# EAGLE design FEU_Last (EAGLE 6.1)
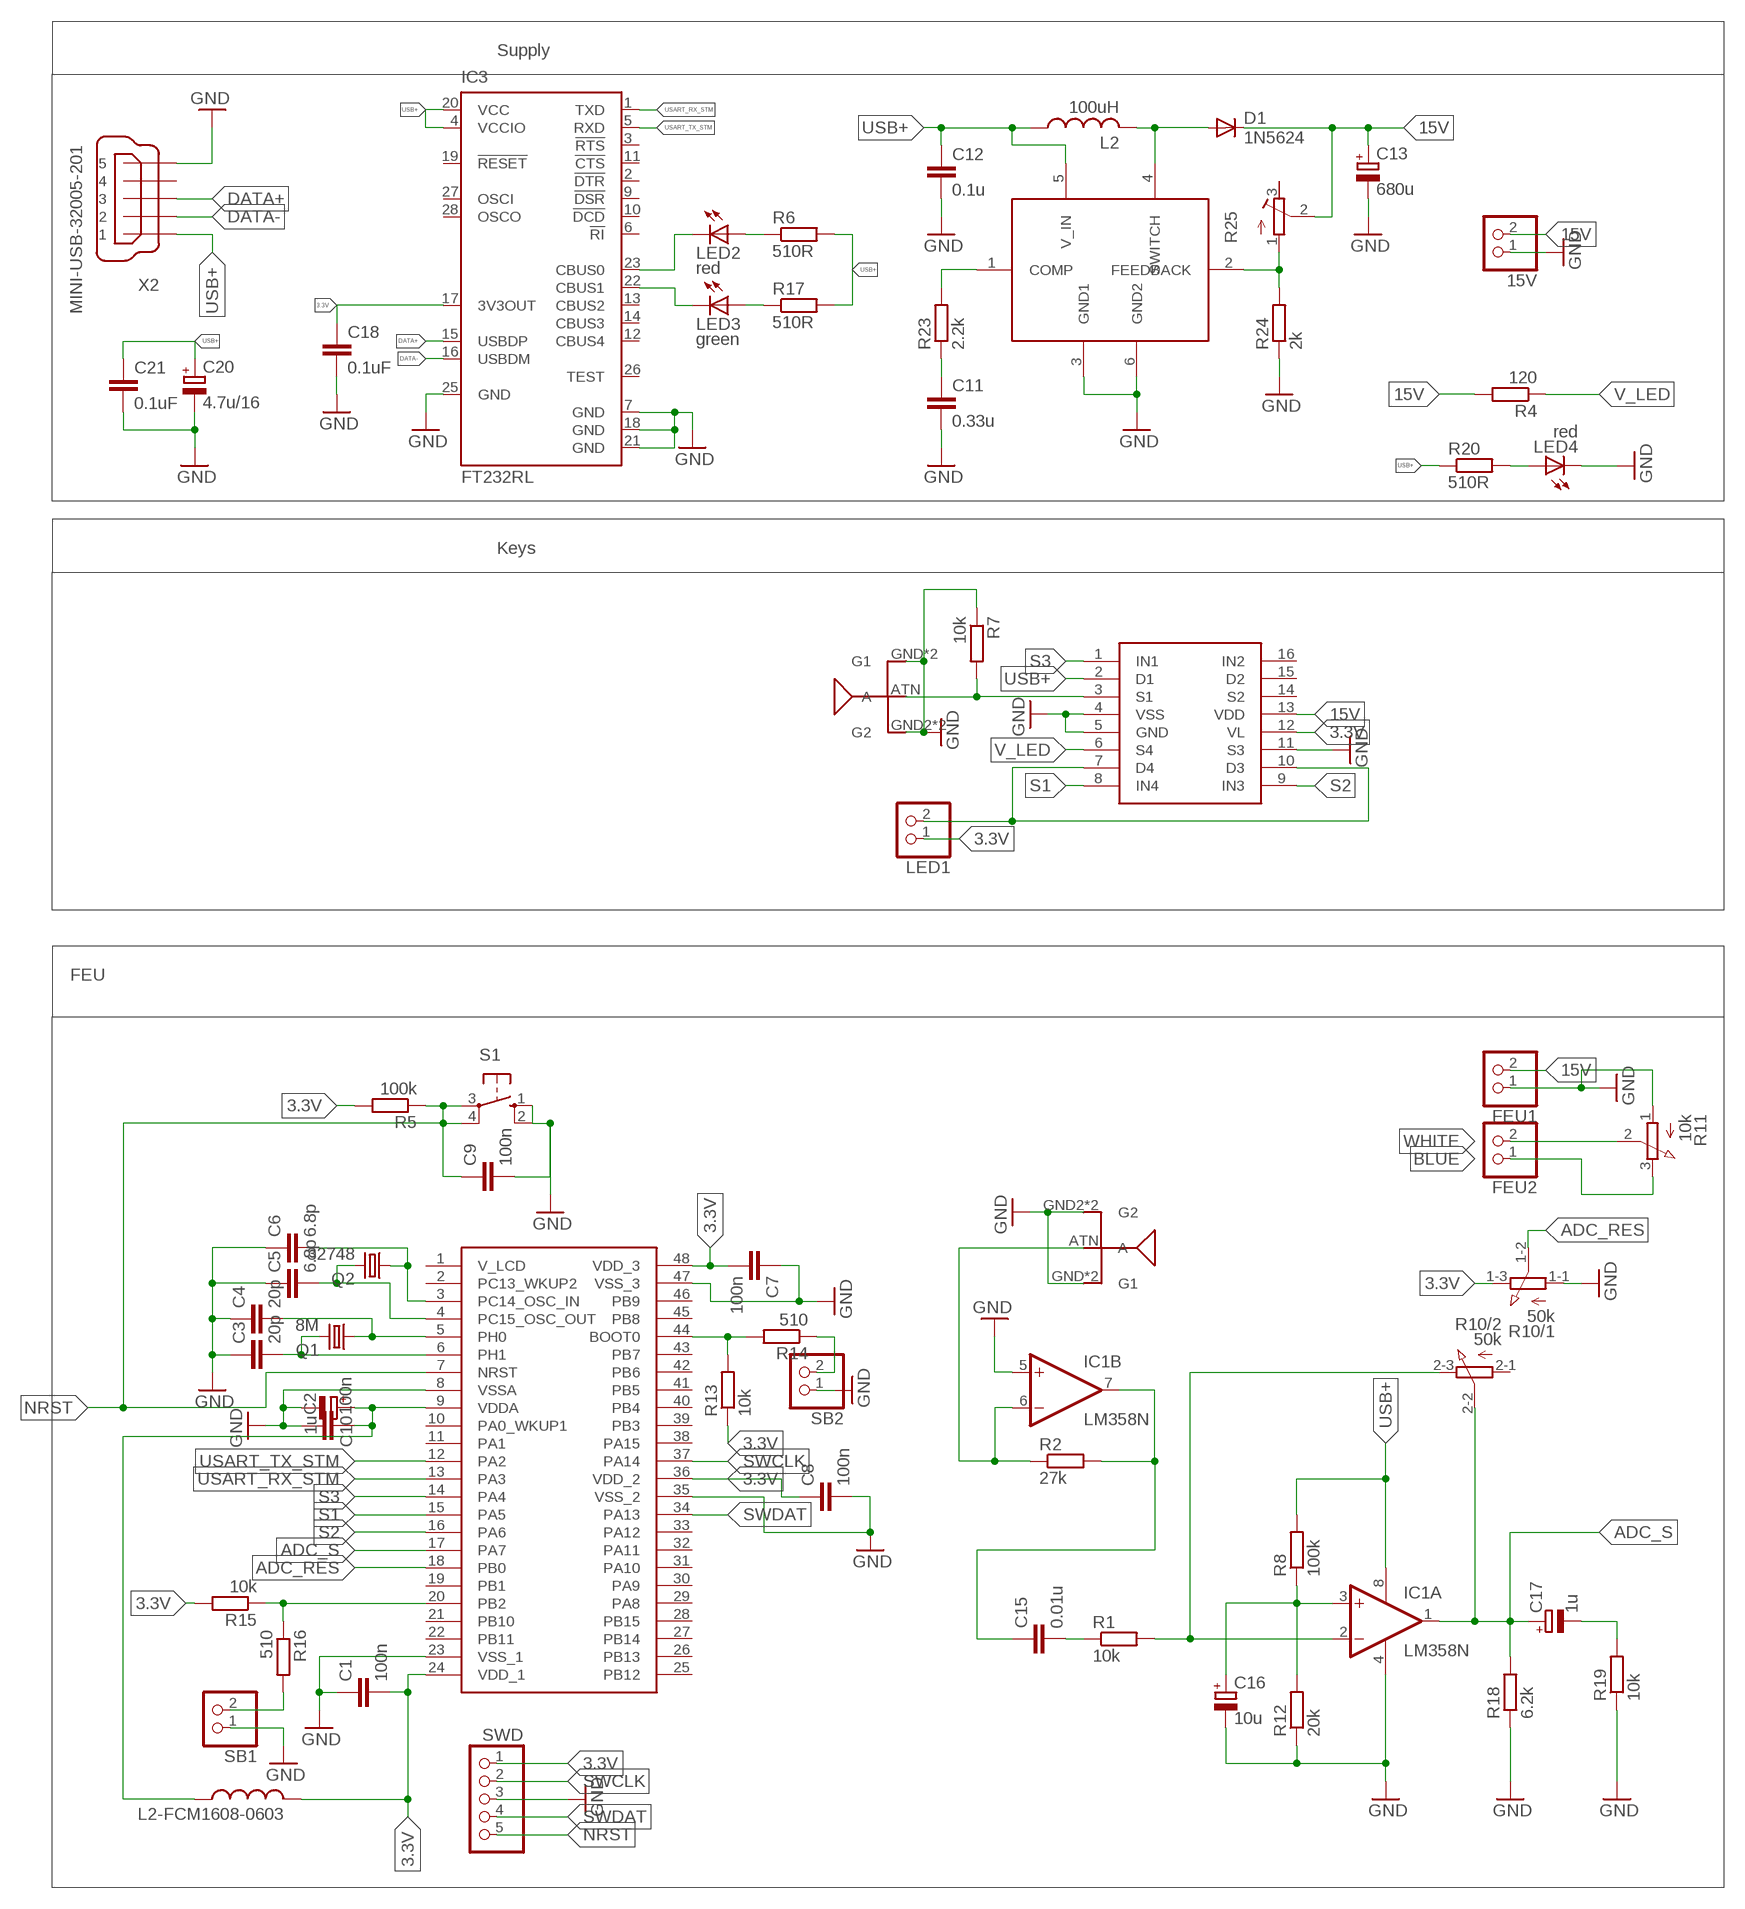
[diagram p0: schematic, sheet 1]

## Parts
15V  PINHD-1X2  [1X02]
C1  100n  C-EUC0805  [C0805]
C2  100n  C-EUC0805  [C0805]
C3  20p  C-EUC0805  [C0805]
C4  20p  C-EUC0805  [C0805]
C5  6.8p  C-EUC0805  [C0805]
C6  6.8p  C-EUC0805  [C0805]
C7  100n  C-EUC0805  [C0805]
C8  100n  C-EUC0805  [C0805]
C9  100n  C-EUC0805  [C0805]
C10  1u  CPOL-EUA/3216-18W  [A/3216-18W]
C11  0.33u  C-EUC0805  [C0805]
C12  0.1u  C-EUC0805  [C0805]
C13  680u  CPOL-EUE5-5  [E5-5]
C15  0.01u  C-EUC0805  [C0805]
C16  10u  CPOL-EUE3.5-8  [E3,5-8]
C17  1u  CPOL-EUE3.5-8  [E3,5-8]
C18  0.1uF  C-EUC0805  [C0805]
C20  4.7u/16  CPOL-EUE2-5  [E2-5]
C21  0.1uF  C-EUC0805  [C0805]
D1  1N5624  [DO201-15]
FEU1  PINHD-1X2  [1X02]
FEU2  PINHD-1X2  [1X02]
IC1  LM358N  [DIL08]
IC3  FT232RL  [SSOP28]
L2  100uH  L-US0207/5V  [0207/5V]
L2-FCM1608-0603  L-USL3216C  [L3216C]
LED1  PINHD-1X2  [1X02]
LED2  red  LEDCHIPLED_1206  [CHIPLED_1206]
LED3  green  LEDCHIPLED_1206  [CHIPLED_1206]
LED4  red  LEDCHIPLED_1206  [CHIPLED_1206]
Q1  8M  CRYSTALHC49S  [HC49/S]
Q2  32748  CRYSTALTC26H  [TC26H]
R1  10k  R-EU_R0805  [R0805]
R2  27k  R-EU_R0805  [R0805]
R4  120  R-EU_R0805  [R0805]
R5  100k  R-EU_R0805  [R0805]
R6  510R  R-EU_R0805W  [R0805W]
R7  10k  R-EU_R0805  [R0805]
R8  100k  R-EU_R0805  [R0805]
R10  50k  3RP/1610G  [3RP/1610G]
R11  10k  3RP/1610N  [3RP/1610N]
R12  20k  R-EU_R0805  [R0805]
R13  10k  R-EU_R0805  [R0805]
R14  510  R-EU_R0805  [R0805]
R15  10k  R-EU_M0805  [M0805]
R16  510  R-EU_R0805  [R0805]
R17  510R  R-EU_R0805W  [R0805W]
R18  6.2k  R-EU_R0805  [R0805]
R19  10k  R-EU_R0805  [R0805]
R20  510R  R-EU_R0805W  [R0805W]
R23  2.2k  R-EU_R0805  [R0805]
R24  2k  R-EU_R0805  [R0805]
R25  R-TRIMM3339P  [RTRIM3339P]
S1  10-XX  [B3F-10XX]
SB1  PINHD-1X2  [1X02]
SB2  PINHD-1X2  [1X02]
SWD  PINHD-1X5  [1X05]
U$1  STM32L152C6  [LQFP48]
U$2  GSM_ANT  [GSM]
U$3  GSM_ANT  [GSM]
U$4  LM2577  [TO263-5]
U$5  ADG433BN  [DIL16]
X2  MINI-USB-32005-201  [32005-201]

## Nets
3.3V: C1.2 C7.2 C8.1 C18.1 IC3.17(3V3OUT) L2-FCM1608-0603.2 LED1.1 R5.2 R10.1-3(/1:E) R13.1 R15.2 SWD.1 U$1.24(VDD_1) U$1.36(VDD_2) U$1.48(VDD_3) U$5.12(VL)
15V: 15V.2 C13.+ D1.C FEU1.2 R4.2 R25.2(S) U$5.13(VDD)
ADC_RES: R10.1-2(/1:S) U$1.18(PB0)
ADC_S: C17.+ IC1.1(A:OUT) R10.2-2(/2:S) R18.2 U$1.17(PA7)
BLUE: FEU2.1 R11.3(E)
DATA+: IC3.15(USBDP) X2.3
DATA-: IC3.16(USBDM) X2.2
GND: 15V.1 C1.1 C2.1 C3.1 C4.1 C5.1 C6.1 C7.1 C8.2 C9.2 C10.- C11.2 C12.2 C13.- C16.- C18.2 C20.- C21.2 FEU1.1 IC1.4(P:V-) IC1.5(B:+IN) IC3.7(GND) IC3.18(GND) IC3.21(GND) IC3.25(GND) LED4.C R7.1 R10.1-1(/1:A) R11.1(A) R12.1 R18.1 R19.1 R24.1 S1.1(S) S1.2(S1) SB1.1 SB2.1 SWD.3 U$1.8(VSSA) U$1.23(VSS_1) U$1.35(VSS_2) U$1.47(VSS_3) U$2.GND1(G1) U$2.GND2(G2) U$2.GND3(G2) U$2.GND(G1) U$3.GND1(G1) U$3.GND2(G2) U$3.GND3(G2) U$3.GND(G1) U$4.3(GND1) U$4.6(GND2) U$5.4(VSS) U$5.5(GND) U$5.11(S3) X2.5
N$1: C4.2 Q1.1 U$1.5(PH0)
N$2: C3.2 Q1.2 U$1.6(PH1)
N$3: IC3.22(CBUS1) LED3.C
N$4: LED1.2 U$5.7(D4) U$5.10(D3)
N$5: IC3.23(CBUS0) LED2.C
N$6: IC1.6(B:-IN) R2.1 U$2.ATN(A)
N$7: C15.1 IC1.7(B:OUT) R2.2
N$9: C15.2 R1.1
N$10: C16.+ IC1.3(A:+IN) R8.1 R12.2
N$11: IC1.2(A:-IN) R1.2 R10.2-3(/2:E)
N$12: LED2.A R6.1
N$13: C5.2 Q2.2 U$1.4(PC15_OSC_OUT)
N$14: C6.2 Q2.1 U$1.3(PC14_OSC_IN)
N$15: C2.2 C10.+ L2-FCM1608-0603.1 U$1.9(VDDA)
N$16: R13.2 R14.2 U$1.44(BOOT0)
N$17: R16.2 SB1.2
N$18: R14.1 SB2.2
N$19: R15.1 R16.1 U$1.20(PB2)
N$20: C17.- R19.2
N$21: LED3.A R17.1
N$23: R7.2 U$3.ATN(A) U$5.3(S1)
N$24: LED4.A R20.2
N$26: R23.2 U$4.1(COMP)
N$27: C11.1 R23.1
N$28: R24.2 R25.1(E) U$4.2(FEEDBACK)
N$31: D1.A L2.2 U$4.4(SWITCH)
NRST: C9.1 R5.1 S1.3(P) S1.4(P1) SWD.5 U$1.7(NRST)
S1: U$1.15(PA5) U$5.8(IN4)
S2: U$1.16(PA6) U$5.9(IN3)
S3: U$1.14(PA4) U$5.1(IN1)
SWCLK: SWD.2 U$1.37(PA14)
SWDAT: SWD.4 U$1.34(PA13)
USART_RX_STM: IC3.1(TXD) U$1.13(PA3)
USART_TX_STM: IC3.5(RXD) U$1.12(PA2)
USB+: C12.1 C20.+ C21.1 IC1.8(P:V+) IC3.4(VCCIO) IC3.20(VCC) L2.1 R6.2 R8.2 R17.2 R20.1 U$4.5(V_IN) U$5.2(D1) X2.1
V_LED: R4.1 U$5.6(S4)
WHITE: FEU2.2 R11.2(S)
Unconnected: IC3.2(!DTR) IC3.3(!RTS) IC3.6(!RI) IC3.9(!DSR) IC3.10(!DCD) IC3.11(!CTS) IC3.12(CBUS4) IC3.13(CBUS2) IC3.14(CBUS3) IC3.19(!RESET) IC3.26(TEST) IC3.27(OSCI) IC3.28(OSCO) R10.2-1(/2:A) R25.3(A) U$1.1(V_LCD) U$1.2(PC13_WKUP2) U$1.10(PA0_WKUP1) U$1.11(PA1) U$1.19(PB1) U$1.21(PB10) U$1.22(PB11) U$1.25(PB12) U$1.26(PB13) U$1.27(PB14) U$1.28(PB15) U$1.29(PA8) U$1.30(PA9) U$1.31(PA10) U$1.32(PA11) U$1.33(PA12) U$1.38(PA15) U$1.39(PB3) U$1.40(PB4) U$1.41(PB5) U$1.42(PB6) U$1.43(PB7) U$1.45(PB8) U$1.46(PB9) U$5.14(S2) U$5.15(D2) U$5.16(IN2) X2.4

## Notes on the sheet
- Supply
- Keys
- FEU

## Library data of the parts
15V FEU1 FEU2 LED1 SB1 SB2 = pinhead:PINHD-1X2: PIN HEADER
C1-C9 C11 C12 C15 C18 C21 = resistor:C-EU: CAPACITOR, European symbol
C10 C13 C16 C17 C20 = resistor:CPOL-EU: POLARIZED CAPACITOR, European symbol
D1 = diode:1N5624: DIODE controlled avalanche rectifier
IC1 = linear:LM358: OP AMP also LM158; LM258; LM2904 Source: http://cache.national.com/ds/LM/LM158.pdf
IC3 = ftdichip:FT232R: Source: http://www.ftdichip.com/Documents/DataSheets/DS_FT232R_v104.pdf; MPN: FT232RL; OC_FARNELL: 1146032; OC_NEWARK: 91K9918
L2 L2-FCM1608-0603 = resistor:L-US: INDUCTOR, American symbol
LED2-LED4 = led:LED: LED OSRAM: - CHIPLED LG R971, LG N971, LY N971, LG Q971, LY Q971, LO R971, LY R971 LH N974, LH R974 LS Q976, LO Q976, LY Q976 LO Q996 - Hyper CHIPLED LW Q18S LB Q993, LB Q99A, LB R99A - SideLED LS A670, LO A670, LY A670, LG A670, LP A670 LB A673, LV A673, LT A673, LW A673 LH A674 LY A675 LS A676, LA A676, LO A676, LY A676, LW A676 LS A679, LY A679, LG A679 - Hyper Micro SIDELED® LS Y876, LA Y876, LO Y876, LY Y876 LT Y87S - SmartLED LW L88C, LW L88S LB L89C, LB L89S, LG L890 LS L89K, LO L89K, LY L89K LS L896, LA L896, LO L896, LY L896 - TOPLED LS T670, LO T670, LY T670, LG T670, LP T670 LSG T670, LSP T670, LSY T670, LOP T670, LYG T670 LG T671, LOG T671, LSG T671 LB T673, LV T673, LT T673, LW T673 LH T674 LS T676, LA T676, LO T676, LY T676, LB T676, LH T676, LSB T676, LW T676 LB T67C, LV T67C, LT T67C, LS T67K, LO T67K, LY T67K, LW E67C LS E67B, LA E67B, LO E67B, LY E67B, LB E67C, LV E67C, LT E67C LW T67C LS T679, LY T679, LG T679 LS T770, LO T770, LY T770, LG T770, LP T770 LB T773, LV T773, LT T773, LW T773 LH T774 LS E675, LA E675, LY E675, LS T675 LS T776, LA T776, LO T776, LY T776, LB T776 LHGB T686 LT T68C, LB T68C - Hyper Mini TOPLED® LB M676 - Mini TOPLED Santana® LG M470 LS M47K, LO M47K, LY M47K Source: http://www.osram.convergy.de LUXEON: - LUMILED® LXK2-PW12-R00, LXK2-PW12-S00, LXK2-PW14-U00, LXK2-PW14-V00 LXK2-PM12-R00, LXK2-PM12-S00, LXK2-PM14-U00 LXK2-PE12-Q00, LXK2-PE12-R00, LXK2-PE12-S00, LXK2-PE14-T00, LXK2-PE14-U00 LXK2-PB12-K00, LXK2-PB12-L00, LXK2-PB12-M00, LXK2-PB14-N00, LXK2-PB14-P00, LXK2-PB14-Q00 LXK2-PR12-L00, LXK2-PR12-M00, LXK2-PR14-Q00, LXK2-PR14-R00 LXK2-PD12-Q00, LXK2-PD12-R00, LXK2-PD12-S00 LXK2-PH12-R00, LXK2-PH12-S00 LXK2-PL12-P00, LXK2-PL12-Q00, LXK2-PL12-R00 Source: www.luxeon.com KINGBRIGHT: KA-3528ASYC Source: www.kingbright.com
Q1 = crystal:CRYSTAL: CRYSTAL; OC_FARNELL: 1667008; OC_NEWARK: unknown
Q2 = crystal:CRYSTAL: CRYSTAL; OC_FARNELL: unknown; OC_NEWARK: unknown
R1 R2 R4-R8 R12-R20 R23 R24 = resistor:R-EU_: RESISTOR, European symbol
R10 = pot:3RP/1610G: 16mm Potentiometer two level Source: http://www.alphapotentiometers.net/html/16mm_pot_2.html
R11 = pot:3RP/1610N: 16mm Potentiometer one level Source: http://www.alphapotentiometers.net/html/16mm_pot_2.html
R25 = resistor:R-TRIMM: Trimm resistor
S1 = switch-omron:10-XX: OMRON SWITCH; MPN: B3F-1000; OC_FARNELL: 176432; OC_NEWARK: 36M3542
SWD = pinhead:PINHD-1X5: PIN HEADER
U$1 = STM32L152:STM32L152C6
U$2 U$3 = discrete:GSM_ANT
U$4 = LM2577:LM2577
U$5 = ADG433:ADG433BN
X2 = con-cypressindustries:MINI-USB-: MINI USB-B Conector Source: www.cypressindustries.com; OC_FARNELL: unknown; OC_NEWARK: unknown

## Board
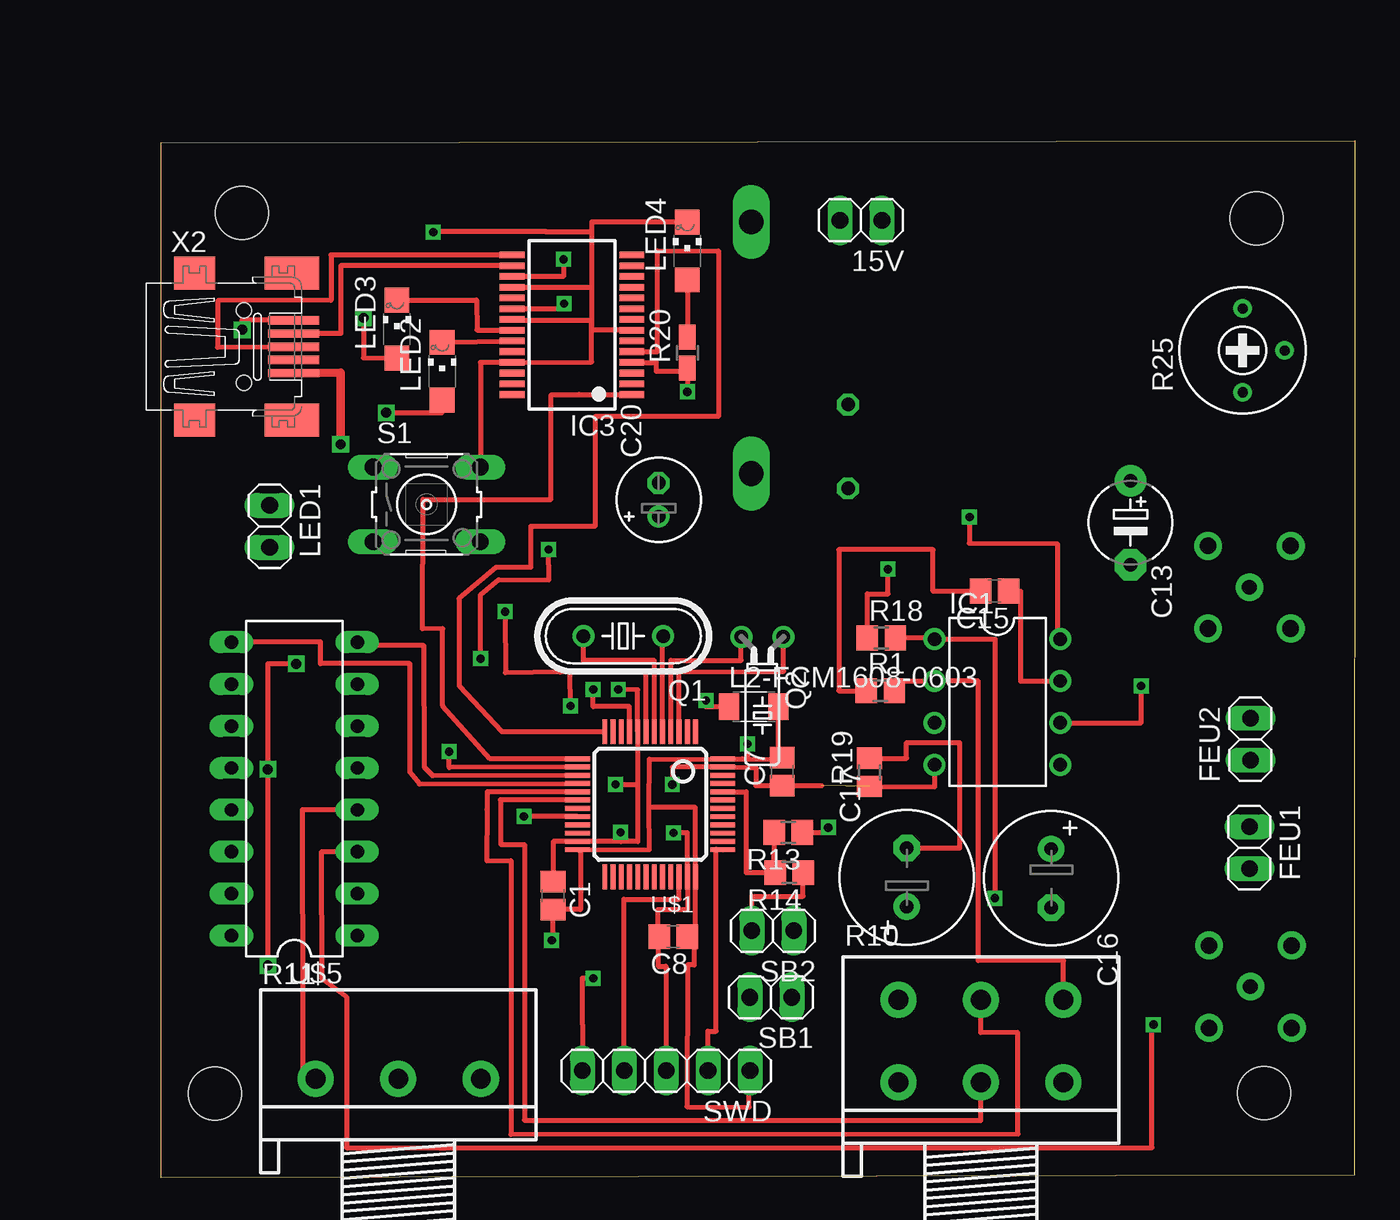
[diagram p1: board, top side]
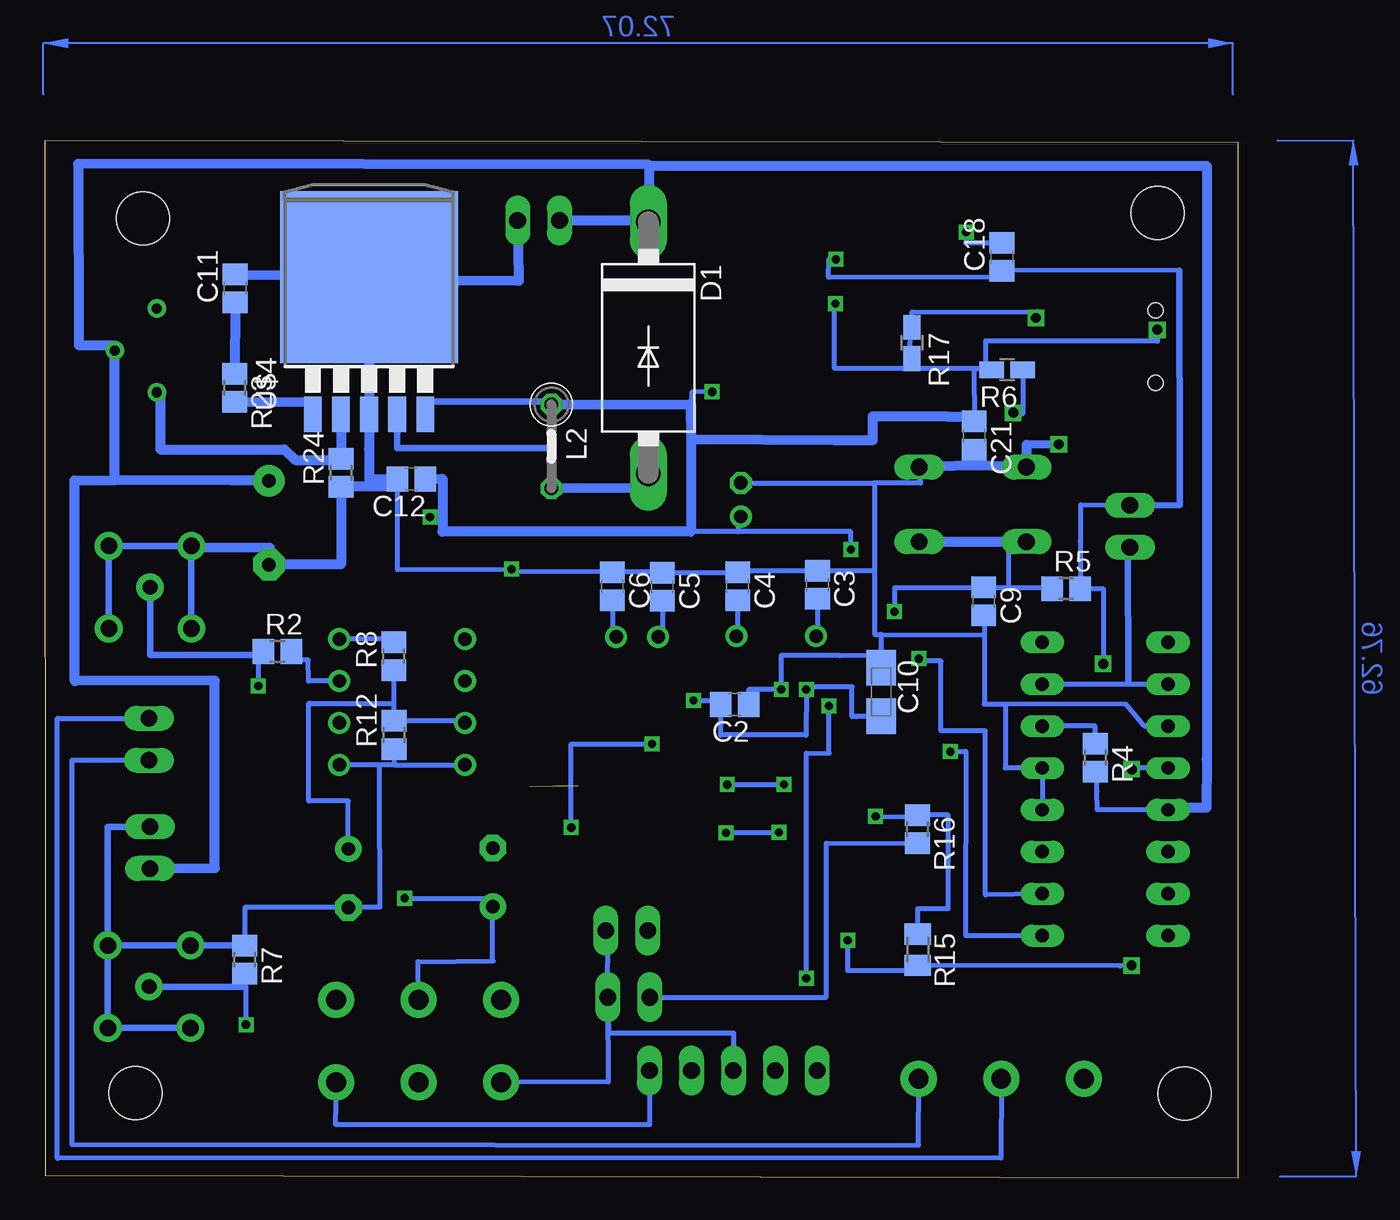
[diagram p2: board, bottom side, seen from below]

Size 72.31 x 62.84 mm. Coordinates in mm from the lower left corner, seen from the top.
Outline: 0.01,62.7 72.31,62.84 72.3,0.14 0,0 0.01,62.7
Copper layers (1*16): Top 0.035mm / dielectric 1.5mm / Bottom 0.035mm
Design rules: minimum track width 10mil, minimum drill 24mil, track to track 8mil, track to pad 8mil, pad to pad 8mil, via to via 8mil, smd to smd 8mil, copper to edge 40mil, drill to drill 8mil, minimum pad ring 10mil, minimum via ring 8mil, stop-mask expansion 4mil, vias tented up to drill 0mil, thermal gap 10mil
Holes 3.2 mm at 4.89,58.45 3.25,5.1 66.36,58.13 66.83,5.12

### Footprints (pad centres in the part's own frame; a part is rotated, then mirrored left to right if it is on the bottom)
1X02 = drill 1.016 long: 1 -1.27,0; 2 1.27,0
C0805 = smd 1.3 x 1.5: 1 -0.85,0; 2 0.85,0
A/3216-18W = smd 2.15 x 1.8: + 1.475,0; - -1.475,0
E5-5 = drill 0.813 pad 1.905: + -2.54,0 | drill 0.813 pad 1.905 octagon: - 2.54,0
E3,5-8 = drill 0.813 pad 1.6: + -1.778,0 | drill 0.813 pad 1.6 octagon: - 1.778,0
E2-5 = drill 0.813 pad 1.27: + -1.016,0 | drill 0.813 pad 1.27 octagon: - 1.016,0
DO201-15 = drill 1.499 long: A 7.62,0; C -7.62,0
DIL08 = drill 0.813 pad 1.27: 1 -3.81,-3.81; 2 -1.27,-3.81; 3 1.27,-3.81; 4 3.81,-3.81; 5 3.81,3.81; 6 1.27,3.81; 7 -1.27,3.81; 8 -3.81,3.81
SSOP28 = smd 0.4 x 1.5: 1 -4.225,-3.625; 2 -3.575,-3.625; 3 -2.925,-3.625; 4 -2.275,-3.625; 5 -1.625,-3.625; 6 -0.975,-3.625; 7 -0.325,-3.625; 8 0.325,-3.625; 9 0.975,-3.625; 10 1.625,-3.625; 11 2.275,-3.625; 12 2.925,-3.625; 13 3.575,-3.625; 14 4.225,-3.625; 15 4.225,3.625; 16 3.575,3.625; 17 2.925,3.625; 18 2.275,3.625; 19 1.625,3.625; 20 0.975,3.625; 21 0.325,3.625; 22 -0.325,3.625; 23 -0.975,3.625; 24 -1.625,3.625; 25 -2.275,3.625; 26 -2.925,3.625; 27 -3.575,3.625; 28 -4.225,3.625
0207/5V = drill 0.813 octagon: 1 -2.54,0; 2 2.54,0
L3216C = smd 1.2 x 1.6: 1 -1.5,0; 2 1.5,0
CHIPLED_1206 = smd 1.5 x 1.5: A 0,-1.75; C 0,1.75
HC49/S = drill 0.813: 1 -2.413,0; 2 2.413,0
TC26H = drill 0.813: 1 -1.27,0; 2 1.27,0
R0805 = smd 1.3 x 1.5: 1 -0.85,0; 2 0.85,0
R0805W = smd 1.5 x 1: 1 -0.94,0; 2 0.94,0
3RP/1610G = drill 1.2 pad 2.184: 1-1 -5,0; 1-2 0,0; 1-3 5,0; 2-1 -5,5; 2-2 0,5; 2-3 5,5
3RP/1610N = drill 1.2 pad 2.184: 1 -5,0; 2 0,0; 3 5,0
M0805 = smd 1.3 x 1.6: 1 -0.95,0; 2 0.95,0
RTRIM3339P = drill 0.61: 1 -2.54,0; 2 0,-2.54; 3 2.54,0
B3F-10XX = drill 1.016 long: 1 -3.251,2.261; 2 3.251,2.261; 3 -3.251,-2.261; 4 3.251,-2.261
1X05 = drill 1.016 long: 1 -5.08,0; 2 -2.54,0; 3 0,0; 4 2.54,0; 5 5.08,0
LQFP48 = smd 0.3 x 1.5: 1 -2.75,-4.4; 2 -2.25,-4.4; 3 -1.75,-4.4; 4 -1.25,-4.4; 5 -0.75,-4.4; 6 -0.25,-4.4; 7 0.25,-4.4; 8 0.75,-4.4; 9 1.25,-4.4; 10 1.75,-4.4; 11 2.25,-4.4; 12 2.75,-4.4; 25 2.75,4.4; 26 2.25,4.4; 27 1.75,4.4; 28 1.25,4.4; 29 0.75,4.4; 30 0.25,4.4; 31 -0.25,4.4; 32 -0.75,4.4; 33 -1.25,4.4; 34 -1.75,4.4; 35 -2.25,4.4; 36 -2.75,4.4 | smd 1.5 x 0.3: 13 4.4,-2.75; 14 4.4,-2.25; 15 4.4,-1.75; 16 4.4,-1.25; 17 4.4,-0.75; 18 4.4,-0.25; 19 4.4,0.25; 20 4.4,0.75; 21 4.4,1.25; 22 4.4,1.75; 23 4.4,2.25; 24 4.4,2.75; 37 -4.4,2.75; 38 -4.4,2.25; 39 -4.4,1.75; 40 -4.4,1.25; 41 -4.4,0.75; 42 -4.4,0.25; 43 -4.4,-0.25; 44 -4.4,-0.75; 45 -4.4,-1.25; 46 -4.4,-1.75; 47 -4.4,-2.25; 48 -4.4,-2.75
GSM = drill 0.9 pad 1.676: ATN 0,0 | drill 1 pad 1.676: GND -2.5,2.5; GND1 -2.5,-2.5; GND2 2.5,-2.5; GND3 2.5,2.5
TO263-5 = smd 1.067 x 2.159: 1 -3.404,-7.061; 2 -1.702,-7.061; 3 0,-7.061; 4 1.702,-7.061; 5 3.404,-7.061 | smd 10.8 x 10.41: 6 0,1.27
DIL16 = drill 0.813 long: 1 -7.62,-3.81; 2 -5.08,-3.81; 3 -2.54,-3.81; 4 0,-3.81; 5 2.54,-3.81; 6 5.08,-3.81; 7 7.62,-3.81; 8 10.16,-3.81; 9 10.16,3.81; 10 7.62,3.81; 11 5.08,3.81; 12 2.54,3.81; 13 0,3.81; 14 -2.54,3.81; 15 -5.08,3.81; 16 -7.62,3.81
32005-201 = smd 3.1 x 0.5: 1 3,1.6; 2 3,0.8; 3 3,0; 4 3,-0.8; 5 3,-1.6 | smd 2.5 x 2: M1 -3,-4.45; M2 -3,4.45 | smd 3.3 x 2: M3 2.9,4.45; M4 2.9,-4.45 | hole 0.9: 0,2.2; 0,-2.2

### Placement (x,y rotation side)
15V  42.4,58.01 180 top
C1  23.74,17.1 270 top
C2  30.52,28.68 180 bottom
C3  25.51,35.93 270 bottom
C4  30.34,35.84 270 bottom
C5  34.9,35.8 270 bottom
C6  37.93,35.84 270 bottom
C7  37.63,24.61 90 top
C8  31.03,14.61 180 top
C9  15.43,34.92 270 bottom
C10  21.64,29.43 270 bottom
C11  60.79,53.88 90 bottom
C12  50.11,42.34 180 bottom
C13  58.73,39.69 270 top
C15  50.51,35.55 180 top
C16  53.93,18.15 270 top
C17  45.18,18.2 90 top
C18  14.33,55.8 90 bottom
C20  30.14,41.08 90 top
C21  16.01,44.97 270 bottom
D1  35.75,50.29 270 bottom
FEU1  65.94,20 270 top
FEU2  66,26.57 90 top
IC1  50.67,28.83 270 top
IC3  24.89,51.68 90 top
L2  41.62,44.31 270 bottom
L2-FCM1608-0603  35.91,28.54 0 top
LED1  6.57,39.47 270 top
LED2  17.03,48.87 0 top
LED3  14.29,51.42 0 top
LED4  31.88,56.15 0 top
Q1  28,32.82 180 top
Q2  36.43,32.77 180 top
R1  43.58,29.51 0 top
R2  58.23,31.88 0 bottom
R4  8.67,25.46 270 bottom
R5  10.44,35.69 0 bottom
R6  14.01,48.96 180 bottom
R7  60.2,13.23 270 bottom
R8  51.17,31.61 90 bottom
R10  49.67,5.78 0 top
R11  14.37,5.99 0 top
R12  51.16,26.83 90 bottom
R13  38,20.93 180 top
R14  38.05,18.49 180 top
R15  19.43,13.82 270 bottom
R16  19.45,21.12 270 bottom
R17  19.78,50.58 270 bottom
R18  43.64,32.7 0 top
R19  42.92,24.56 90 top
R20  31.88,49.99 90 top
R23  60.82,47.87 270 bottom
R24  54.37,42.72 90 bottom
R25  65.53,50.13 90 top
S1  16.09,40.8 0 top
SB1  36.94,10.94 180 top
SB2  37.06,14.97 180 top
SWD  30.6,6.49 180 top
U$1  29.63,22.63 180 top
U$2  65.94,35.78 0 top
U$3  66,11.58 270 top
U$4  52.67,53.31 0 bottom
U$5  8.07,22.29 90 top
X2  5.03,50.35 0 top

### Tracks (layer width: path | path; a pad name or v marks a point on that pad's centre or on a via)
3.3V  (via drill 0.5, 0.6)
  Top 0.305: 35.35,25.38 35.21,25.38 U$1.48 29.58,25.36 29.57,22.43 | 35.35,25.38 37.33,25.36 | 37.33,25.36 C7.2 | 29.57,22.43 32.37,22.43 U$1.36 32.38,13.95 C8.1 32.11,14.06 32.3,14.09 32.3,12.89 31.88,12.89 31.86,4.31 35.63,4.28 35.63,6.35 SWD.1 | 29.57,22.43 29.58,19.89 U$1.24 25.4,19.88 25.4,16.25 C1.2 23.74,14.39 v23.67,14.39 | 37.33,25.36 37.41,25.36 L2-FCM1608-0603.2 | R13.1 40.42,20.93 v40.42,21.22 | v35.52,26.28 35.52,25.38 35.35,25.38 | v24.38,55.65 24.38,54.61 IC3.17 | v6.47,12.86 v6.46,24.75 6.47,31.14 v8.19,31.14
  Bottom 0.305: v40.42,21.22 40.42,26.28 v35.52,26.28 | SWD.1 35.67,3.22 54.69,3.22 54.65,5.95 R10.1-3 | v23.67,14.39 23.67,12.54 19.47,12.55 19.38,12.65 19.65,12.59 R15.2 7.17,12.83 v6.47,12.86 | LED1.1 9.57,40.77 9.57,39.8 9.58,38.57 R5.2 8.19,35.69 v8.19,31.14 | 3.59,54.97 3.58,54.98 C18.1 14.33,54.54 24.83,54.56 24.81,55.65 v24.38,55.65 | U$5.12 6.47,24.83 v6.46,24.75
  Bottom 0.406: LED1.1 3.55,40.76 3.55,42.02 3.59,54.97
15V
  Bottom 0.305: U$5.13 8.56,22.29 8.57,23.4 8.57,24.12 R4.2
  Bottom 0.406: D1.C 35.75,61.33 | 4.14,22.41 U$5.13
  Bottom 0.61: C13.+ 61.03,42.25 68.09,42.26 | 68.09,42.26 R25.2 68.07,50.44 70.26,50.44 70.3,61.44 35.72,61.38 D1.C 36.56,58.03 15V.2 | FEU1.2 62.01,18.77 62.01,30.13 70.5,30.09 70.51,42.25 68.09,42.26 | 35.75,61.33 1.92,61.31 1.92,25.37 1.93,22.41 4.14,22.41
ADC_RES
  Top 0.305: U$1.18 20.56,22.9 20.58,20.2 22.02,20.19 22.01,3.49 49.66,3.48 R10.1-2
ADC_S  (via drill 0.5)
  Top 0.305: R18.2 46.85,32.7 IC1.1 50.52,32.64 v50.52,16.94 | U$1.17 19.75,23.38 19.74,22.29 19.72,19.21 21.19,19.22 21.19,2.63 | 21.19,2.63 21.27,2.65 | 21.19,2.63 51.92,2.65 51.9,8.8 49.66,8.79 R10.2-2
  Bottom 0.305: R10.2-2 49.71,13.09 45.14,13.13 45.18,13.13 C17.+ 45.18,16.94 v50.52,16.94
BLUE
  Bottom 0.305: FEU2.1 70.68,25.3 70.68,2.02 19.38,1.98 R11.3
DATA+
  Top 0.305: IC3.15 10.29,55.91 10.29,53.17 3.43,53.14 3.42,50.32 7.94,50.35 X2.3
DATA-
  Top 0.305: IC3.16 10.88,55.25 10.88,51.15 8.19,51.15 | 7.99,51.15 8.19,51.15 | 8.19,51.15 6.81,51.2 X2.2
GND  (via drill 0.5, 0.6)  (1 unrouted)
  Top 0.305: C1.1 23.75,20.38 U$1.23 27.84,20.38 | 28.88,23.83 U$1.8 28.88,29.57 v27.7,29.58 | 28.88,23.83 28.88,20.38 27.84,20.38 | v30.97,23.82 30.97,24.89 U$1.47 35.66,24.87 36.04,24.86 36.04,23.76 C7.1 40.02,23.76 | v27.53,23.83 28.88,23.83 | v31.04,20.89 31.88,20.9 U$1.35 31.88,16.24 30.08,16.24 30.08,14.48 30.12,13.66 | v27.84,20.92 27.84,20.38 | 42.92,23.75 R19.1 46.87,23.69 IC1.4 | C8.2 30.12,13.66 | 30.12,13.66 30.12,12.81 30.59,12.81 SWD.3 | R18.1 42.79,35.37 44.04,35.37 v44.04,36.87 | U$5.4 8.55,22.29 8.59,9.65 8.59,5.99 R11.1 | IC3.21 21.27,51.97 26.08,51.97 | IC3.7 26.08,51.36 26.08,51.72 | LED4.C 26.08,57.9 26.08,57.33 | 26.08,57.33 26.09,53.96 | 26.09,53.96 26.08,51.72 | 23.31,53.95 IC3.18 23.34,53.95 23.35,53.96 26.09,53.96 | v16.49,57.3 16.49,57.32 23.31,57.32 23.31,57.33 26.08,57.33 | 26.08,51.97 26.09,51.97 26.09,49.42 IC3.25 19.34,49.41 S1.2 | 26.08,51.97 26.08,51.72
  Top 0.5: X2.5 10.87,48.78 v10.88,44.44
  Bottom 0.305: v30.97,23.82 v27.53,23.83 | v31.04,20.89 30.81,20.92 v27.84,20.92 | C2.1 29.67,29.58 v27.7,29.58 27.7,31.63 24.16,31.63 21.69,31.62 C10.- 21.63,32.93 | 22.06,36.78 C3.1 30.34,36.78 C4.1 30.34,36.65 C5.1 34.9,36.69 C6.1 44.04,36.72 v44.04,36.87 50.96,36.85 50.96,41.87 | 22.06,36.78 22.05,32.93 21.63,32.93 | SB1.1 38.19,15.01 SB2.1 | SB1.1 38.18,5.8 R10.1-1 | SB1.1 38.16,8.77 30.59,8.78 30.59,7.4 SWD.3 | R12.1 51.16,25.02 | 51.16,25.02 IC1.4 | U$5.4 U$5.5 14.12,24.83 14.12,28.7 15.4,28.7 | S1.2 19.26,42.09 22.06,42.1 | 22.06,42.1 22.06,36.78 | R7.1 60.2,16.37 C16.- 52.02,16.39 52.06,23.5 52.06,25.02 | 51.16,25.02 52.06,25.02 | C9.2 14.97,33.93 15.4,33.94 15.4,32.9 | 15.4,32.9 15.4,28.7 | C20.- 22.06,42.1 | v16.49,57.3 16.52,56.65 C18.2 | C21.2 16.02,43.14 16.1,43.16 | U$5.11 5.69,27.37 6.8,28.68 15.4,28.7 | 21.63,32.93 15.4,32.9 | 52.06,25.02 IC1.5
  Bottom 0.406: U$3.GND U$3.GND3 U$3.GND2 | U$2.GND2 U$2.GND3 U$2.GND U$2.GND1 | U$3.GND U$3.GND1 R7.1 | FEU1.1 68.5,21.27 U$3.GND
  Bottom 0.5: v10.88,44.44 12.83,44.42
  Bottom 0.61: C11.2 52.67,54.66 U$4.6 | U$4.6 U$4.3 52.67,44.16 52.66,42.32 C12.2 50.96,41.87 R24.1 54.37,37.16 C13.- 58.67,38.18 63.45,38.17 U$2.GND | S1.2 16.1,43.16 S1.1 12.83,44.42 | 51.66,55.59 52.15,55.1 | 52.15,55.1 U$4.6 | 15V.1 43.61,54.35 51.33,54.32 51.33,55.1 52.15,55.1
N$1
  Top 0.305: U$1.5 30.38,32.82 Q1.1
  Bottom 0.305: C4.2 30.34,32.82 Q1.1
N$2
  Top 0.305: U$1.6 29.88,31.33 25.59,31.33 Q1.2
  Bottom 0.305: C3.2 25.51,32.82 Q1.2
N$3
  Top 0.305: LED3.C 19.11,53.18 19.13,51.36 IC3.22
N$4
  Bottom 0.305: U$5.7 6.68,29.91 6.68,29.98 6.61,29.91 U$5.10
  Bottom 0.406: 6.67,38.07 LED1.2 6.7,38.04 6.68,29.98
N$5
  Top 0.305: LED2.C 21.27,50.68 IC3.23
N$6  (via drill 0.5)
  Top 0.305: IC1.6 59.38,27.56 v59.38,29.8
  Bottom 0.305: R2.1 59.37,31.88 | v59.38,29.8 v59.37,29.8 59.37,31.69
  Bottom 0.406: U$2.ATN 65.94,31.69 59.37,31.69 59.37,31.88
N$7
  Top 0.305: C15.1 52.07,35.55 52.07,30.1 IC1.7
  Bottom 0.305: IC1.7 56.34,30.1 56.35,31.37 57.37,31.38 R2.2
N$9
  Top 0.305: C15.2 46.77,35.55 46.77,38.05 41.06,38.05 41.06,29.51 R1.1
N$10
  Bottom 0.305: IC1.3 46.86,27.68 R12.2 51.17,28.74 | R8.1 51.17,28.74 | C16.+ 53.93,22.83 56.33,22.83 56.33,28.74 51.17,28.74
N$11
  Top 0.305: R1.2 44.64,29.91 44.73,30.1 IC1.2 49.51,30.1 49.51,13.16 54.67,13.15 R10.2-3
N$12  (via drill 0.6)
  Top 0.305: v13.64,46.35 17.02,46.35 LED2.A
  Bottom 0.305: R6.1 13.06,49.02 13.06,46.3 v13.64,46.35
N$13
  Top 0.305: U$1.4 30.88,31.35 35.14,31.35 35.14,32.77 Q2.2
  Bottom 0.305: C5.2 34.9,32.77 Q2.2
N$14
  Top 0.305: U$1.3 31.38,30.66 37.72,30.68 37.72,32.79 Q2.1
  Bottom 0.305: C6.2 37.93,32.77 Q2.1
N$15  (via drill 0.5)
  Top 0.305: U$1.9 28.38,28.51 28.37,28.55 26.18,28.55 v26.18,29.58 | L2-FCM1608-0603.1 33.01,28.54 v33.01,28.92
  Bottom 0.305: 31.37,28.91 31.36,26.83 26.19,26.82 v26.18,29.58 26.17,29.75 25.91,29.74 23.4,29.74 23.4,27.95 23.16,27.95 C10.+ | v33.01,28.92 31.37,28.91 | 31.37,28.91 C2.2
N$16
  Top 0.305: U$1.44 35.45,23.38 35.45,18.49 R14.2 37.14,18.53 R13.2
N$17
  Bottom 0.305: SB1.2 24.97,10.94 24.96,20.28 R16.2
N$18
  Top 0.305: SB2.2 35.79,17.06 38.89,17.06 R14.1
N$19  (via drill 0.5)
  Top 0.305: U$1.20 21.98,21.88 v21.98,21.9
  Bottom 0.305: v21.98,21.9 19.46,21.87 R16.1 17.57,21.97 17.57,16.31 19.43,16.31 R15.1
N$20
  Top 0.305: R19.2 45.16,25.41 45.16,26.37 48.38,26.37 48.38,19.96 45.18,19.96 C17.-
N$21  (via drill 0.6)
  Top 0.305: v12.26,52.1 12.26,49.69 LED3.A
  Bottom 0.305: R17.1 19.78,52.46 12.18,52.48 v12.26,52.1
N$23  (via drill 0.5)
  Top 0.305: U$5.3 9.71,19.74 9.73,12.07 11.24,10.96 11.24,1.82 60.04,1.82 60.04,9.28 v60.13,9.28
  Bottom 0.305: v60.13,9.28 60.13,11.58 60.41,11.58
  Bottom 0.406: U$3.ATN 60.41,11.58 60.2,11.58 R7.2
N$24
  Top 0.305: LED4.A R20.2
N$26
  Bottom 0.61: R23.2 56.07,47 U$4.1
N$27
  Bottom 0.61: C11.1 R23.1
N$28
  Bottom 0.61: U$4.2 R24.2 54.45,43.49 57.16,43.49 57.8,44.13 65.31,44.13 65.31,47.52 R25.1
N$31
  Bottom 0.406: L2.2 41.62,44.19 41.71,44.2 50.97,44.21 U$4.4
  Bottom 0.61: D1.A 35.73,41.8 L2.2
NRST  (via drill 0.5)
  Top 0.305: U$1.7 29.38,30.61 25.19,30.64 24.2,30.64 | 24.2,30.64 20.86,30.6 20.85,34.21 v20.84,34.3 | v26.18,12.09 25.51,12.09 SWD.5 | v24.8,28.58 24.79,30.63 24.2,30.64
  Bottom 0.305: 13.91,35.75 13.9,37.86 13.82,38.52 S1.4 | 11.47,35.73 R5.1 11.29,35.75 13.91,35.75 | v20.84,34.3 20.84,35.76 C9.1 13.91,35.77 13.91,35.75 | v26.18,12.09 26.18,25.72 24.8,25.73 v24.8,28.58
  Bottom 0.61: S1.4 S1.3
S1
  Top 0.305: U$1.15 16.47,24.36 15.94,24.88 15.91,32.25 12.15,32.24 U$5.8
S2
  Top 0.305: U$5.9 9.66,32.47 9.66,31.15 15.07,31.15 15.07,24.58 15.65,23.86 U$1.16
S3  (via drill 0.5)
  Top 0.305: U$1.14 17.46,24.86 v17.45,25.82
  Bottom 0.305: v17.45,25.82 16.52,25.84 16.53,14.68 12.19,14.68 U$5.1
SWCLK
  Top 0.305: SWD.2 33.13,8.88 33.62,8.88 33.62,19.9 U$1.37
SWDAT
  Top 0.305: SWD.4 28.04,16.88 31.39,16.88 U$1.34
USART_RX_STM
  Top 0.305: U$1.13 19.94,25.38 17.06,28.59 17.06,33.28 15.83,33.26 15.86,41.1 23.62,41.1 23.64,47.45 25.33,47.45 | 25.33,47.45 25.33,47.46 | 25.33,47.45 IC3.1
USART_TX_STM
  Top 0.305: U$1.12 20.64,27.03 18.06,29.81 18.05,35.09 20.31,36.98 22.39,36.98 22.39,39.47 26.28,39.46 26.29,46.11 33.76,46.13 33.76,56.17 30.07,56.15 30.07,50.05 IC3.5
USB+  (via drill 0.5, 0.6)
  Top 0.305: v48.98,40.03 48.96,38.45 54.3,38.42 54.3,32.64 IC1.8 | v19.36,31.45 19.36,35.34 20.45,36.24 23.49,36.23 v23.48,38.06 | IC3.4 29.99,49.41 29.99,48.87 31.88,48.87 R20.1 v31.88,47.62 | IC3.20 24.41,52.66 v24.41,52.97 | X2.1 4.91,51.96 v4.91,51.38
  Bottom 0.305: R8.2 51.17,32.64 IC1.8 | U$5.2 15.32,17.13 15.33,27.08 18.01,27.08 18.01,31.31 19.35,31.31 v19.36,31.45 | v23.48,38.06 23.48,39.14 30.33,39.15 | 30.33,39.15 33.18,39.15 | v48.98,40.03 48.22,40 48.22,40.21 | C20.+ 30.33,40.06 30.33,39.15 | 16.12,46.11 C21.1 16.02,48.99 R6.2 15.32,48.99 | v31.88,47.62 31.9,47.62 33.12,47.6 33.12,44.72 | v24.41,52.97 24.5,52.97 24.5,49.07 19.91,49.07 | 19.91,49.07 R17.2 19.92,50.53 19.9,50.68 | 19.91,49.07 15.27,49.07 15.32,48.99 | v4.91,51.38 4.9,50.68 15.32,50.7 15.32,48.99
  Bottom 0.406: U$4.5 49.38,46.26 49.37,47.02 41.7,47.02 L2.1
  Bottom 0.61: U$4.5 | L2.1 33.18,46.88 | 33.18,46.88 33.18,39.15 48.22,39.15 48.22,40.21 48.22,42.35 C12.1 | 33.18,46.88 33.12,44.72 24.49,44.68 22.17,44.67 22.17,46.13 17.65,46.12 16.12,46.11
V_LED
  Bottom 0.305: U$5.6 8.85,27.38 8.7,27.38 R4.1
WHITE
  Bottom 0.305: R11.2 14.38,1.2 71.56,1.18 71.56,27.84 FEU2.2
(copper drawn outside any net)
  shapes: Bottom area x2